# EasyEDA schematic info-orbs.json
TITLE: Sheet_1; REV: 1.0; Date: 2024-04-26; Sheet: 1/1; Drawn By: bram verhulst; Company: Your Company
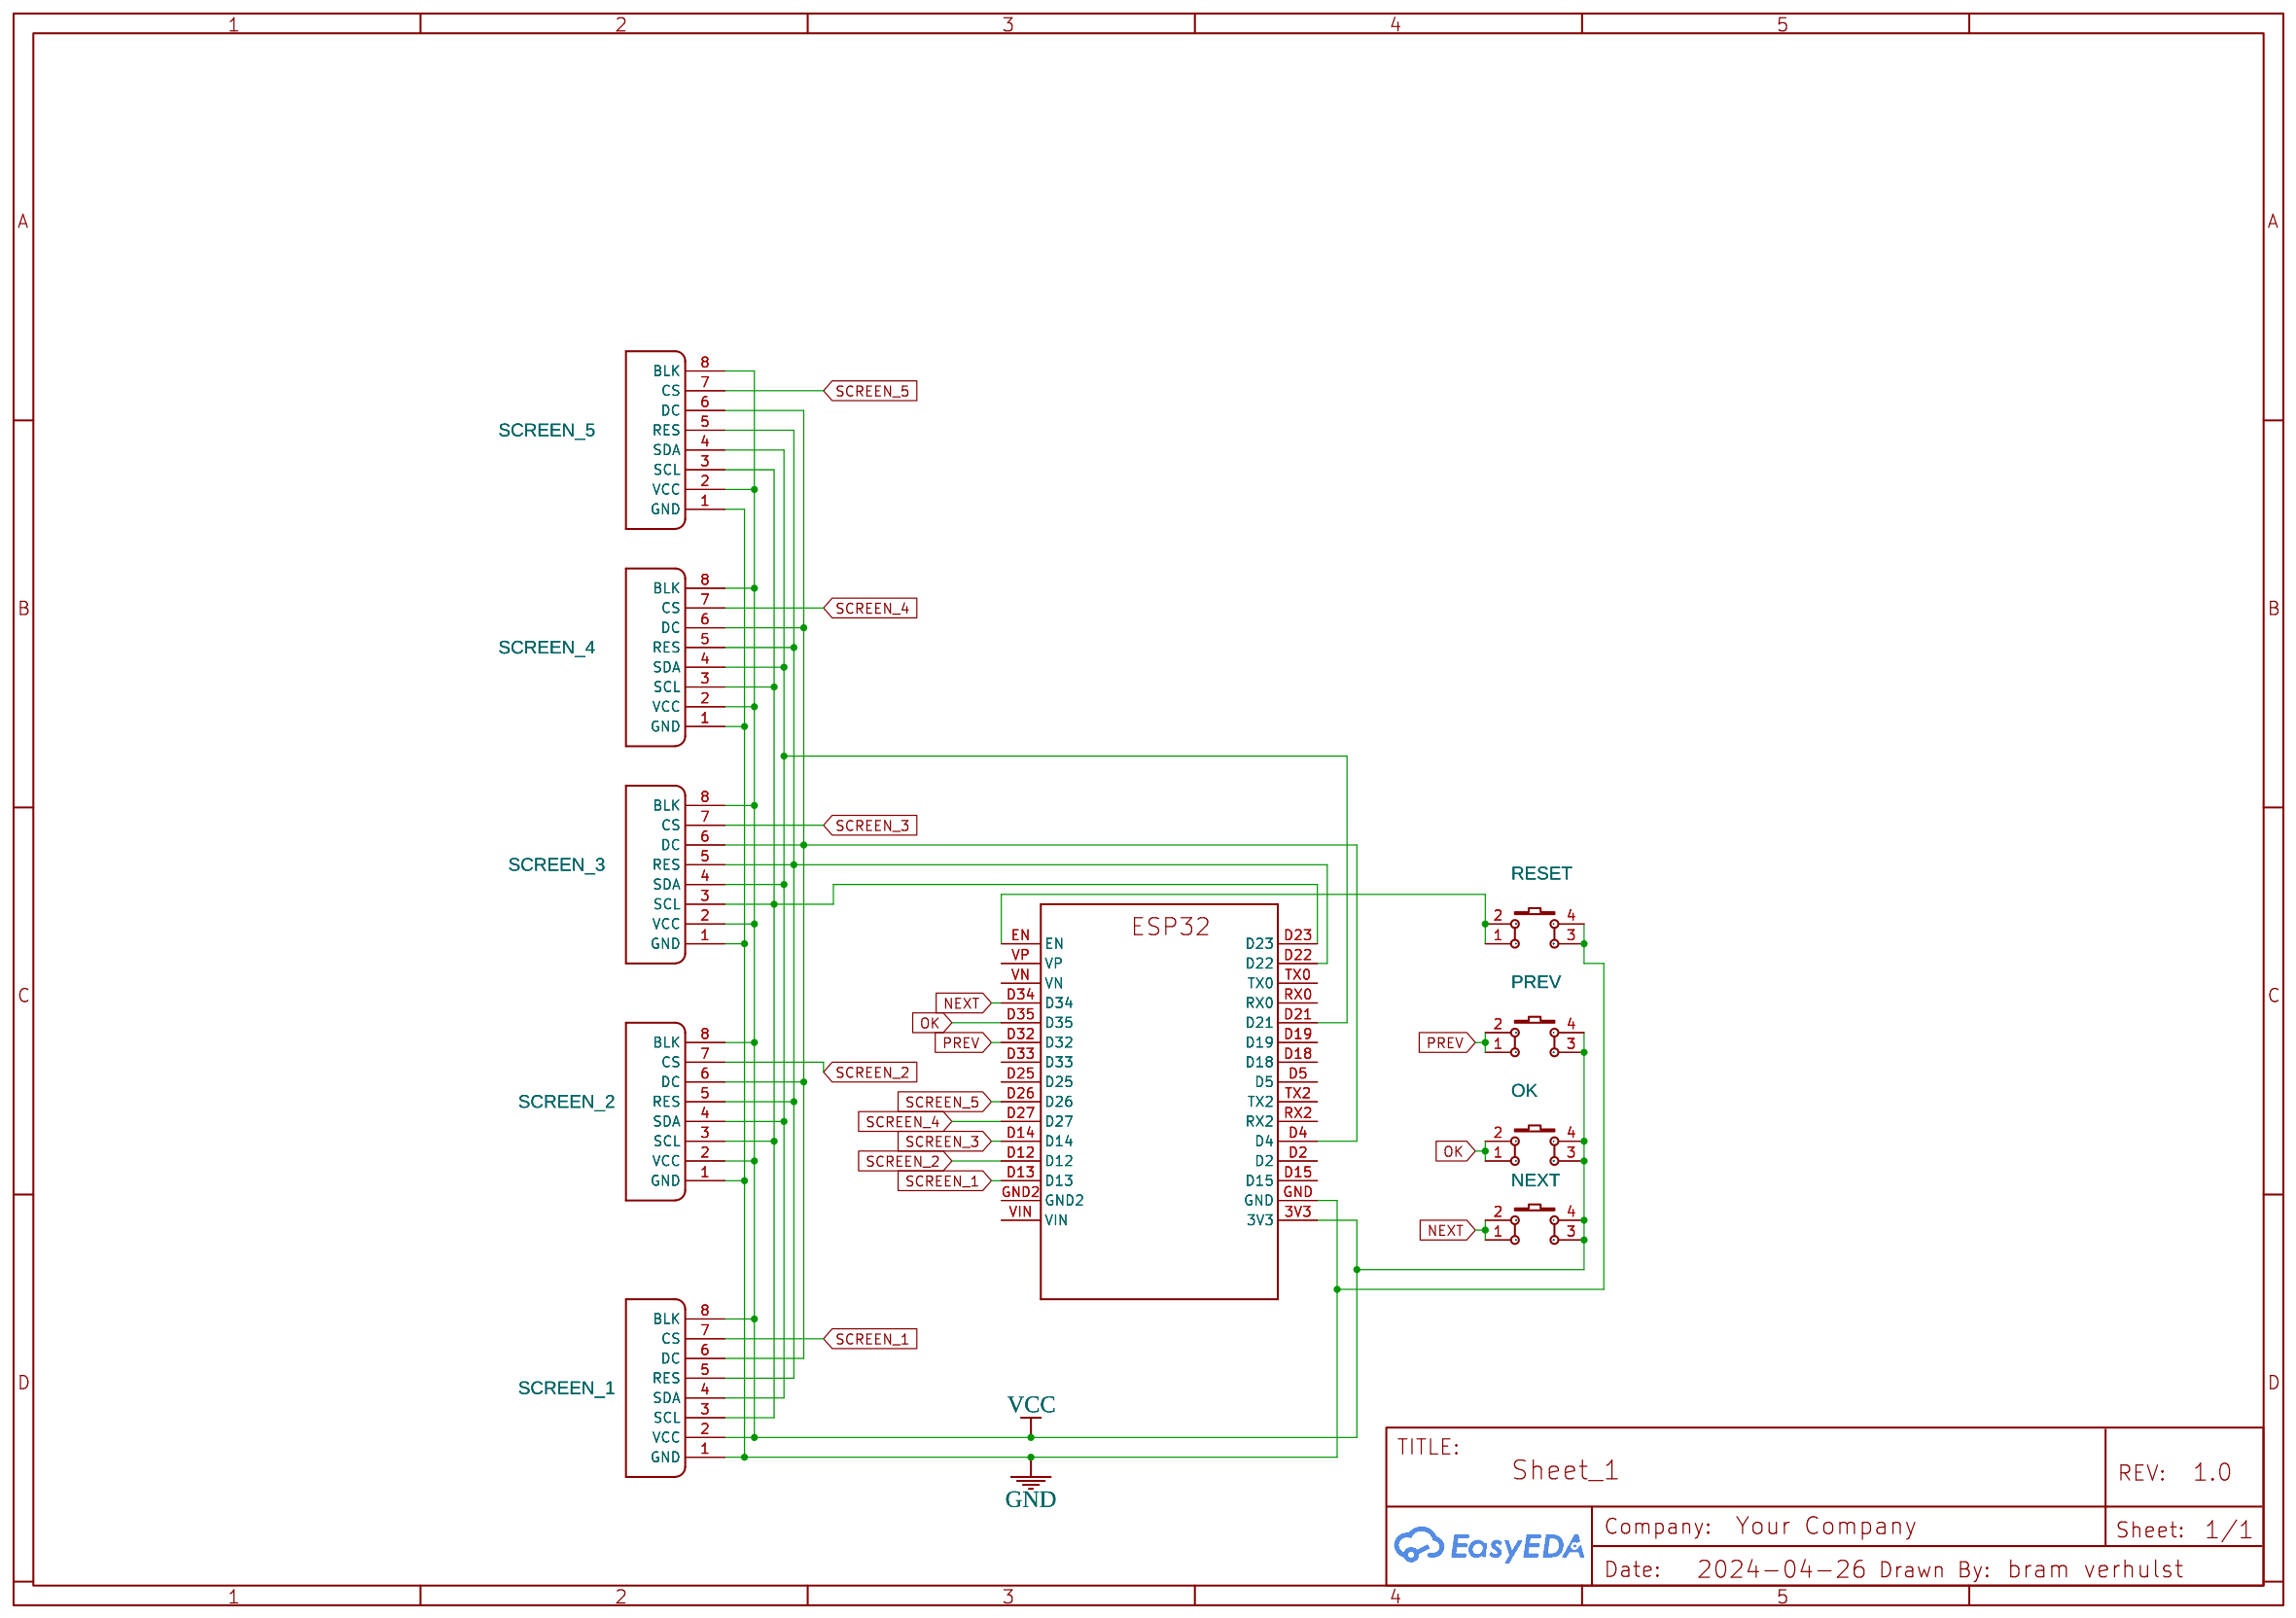
[diagram p0: schematic sheet]

## Parts
1  ESP32-DEVKIT-V1-30PIN COPY 00.2 COPY  [ESP32-DEVKITV1_ESP32-DEVKITV1]
NEXT  K4-6×6_TH  [KEY-TH_4P-L6.0-W6.0-P4.50-LS6.5]
OK  K4-6×6_TH  [KEY-TH_4P-L6.0-W6.0-P4.50-LS6.5]
PREV  K4-6×6_TH  [KEY-TH_4P-L6.0-W6.0-P4.50-LS6.5]
RESET  K4-6×6_TH  [KEY-TH_4P-L6.0-W6.0-P4.50-LS6.5]
SCREEN_1  CHU-8 (DS1069-8 M) GC9A01A  [DS1069-8]
SCREEN_2  CHU-8 (DS1069-8 M) GC9A01A  [DS1069-8]
SCREEN_3  CHU-8 (DS1069-8 M) GC9A01A  [DS1069-8]
SCREEN_4  CHU-8 (DS1069-8 M) GC9A01A  [DS1069-8]
SCREEN_5  CHU-8 (DS1069-8 M) GC9A01A  [DS1069-8]

## Library data of the parts
1 = ESP32-DEVKIT-V1-30PIN: Contributor: u18040382
NEXT OK PREV RESET = K4-6×6_TH: Supplier: LCSC; Supplier Part: C136684; Manufacturer: 韩国韩荣; Manufacturer Part: K2-1102DP-E4SW-04; Contributor: LCEDA_Lib
SCREEN_1-SCREEN_5 = CHU-8 (DS1069-8 M) GC9A01A: Manufacturer Part: DS1069; Supplier: Connfly electronic (Zhenqin); Contributor: Alex5D

## Nets
GND: 1.GND RESET.3 RESET.4 SCREEN_1.1(GND) SCREEN_2.1(GND) SCREEN_3.1(GND) SCREEN_4.1(GND) SCREEN_5.1(GND)
VCC: 1.3V3 NEXT.3 NEXT.4 OK.3 OK.4 PREV.3 PREV.4 SCREEN_1.2(VCC) SCREEN_1.8(BLK) SCREEN_2.2(VCC) SCREEN_2.8(BLK) SCREEN_3.2(VCC) SCREEN_3.8(BLK) SCREEN_4.2(VCC) SCREEN_4.8(BLK) SCREEN_5.2(VCC) SCREEN_5.8(BLK)
NEXT: 1.D34 NEXT.1 NEXT.2
OK: 1.D35 OK.1 OK.2
PREV: 1.D32 PREV.1 PREV.2
SCREEN_1: 1.D13 SCREEN_1.7(CS)
SCREEN_2: 1.D12 SCREEN_2.7(CS)
SCREEN_3: 1.D14 SCREEN_3.7(CS)
SCREEN_4: 1.D27 SCREEN_4.7(CS)
SCREEN_5: 1.D26 SCREEN_5.7(CS)
Net-(1-D4): 1.D4 SCREEN_1.6(DC) SCREEN_2.6(DC) SCREEN_3.6(DC) SCREEN_4.6(DC) SCREEN_5.6(DC)
Net-(1-D21): 1.D21 SCREEN_1.4(SDA) SCREEN_2.4(SDA) SCREEN_3.4(SDA) SCREEN_4.4(SDA) SCREEN_5.4(SDA)
Net-(1-D22): 1.D22 SCREEN_1.5(RES) SCREEN_2.5(RES) SCREEN_3.5(RES) SCREEN_4.5(RES) SCREEN_5.5(RES)
Net-(1-D23): 1.D23 SCREEN_1.3(SCL) SCREEN_2.3(SCL) SCREEN_3.3(SCL) SCREEN_4.3(SCL) SCREEN_5.3(SCL)
Net-(1-EN): 1.EN RESET.1 RESET.2

Not connected (* = marked no-connect by the designer): 1 D2 D5 D15 D18 D19 D25 D33 GND2 RX0 RX2 TX0 TX2 VIN VN VP
